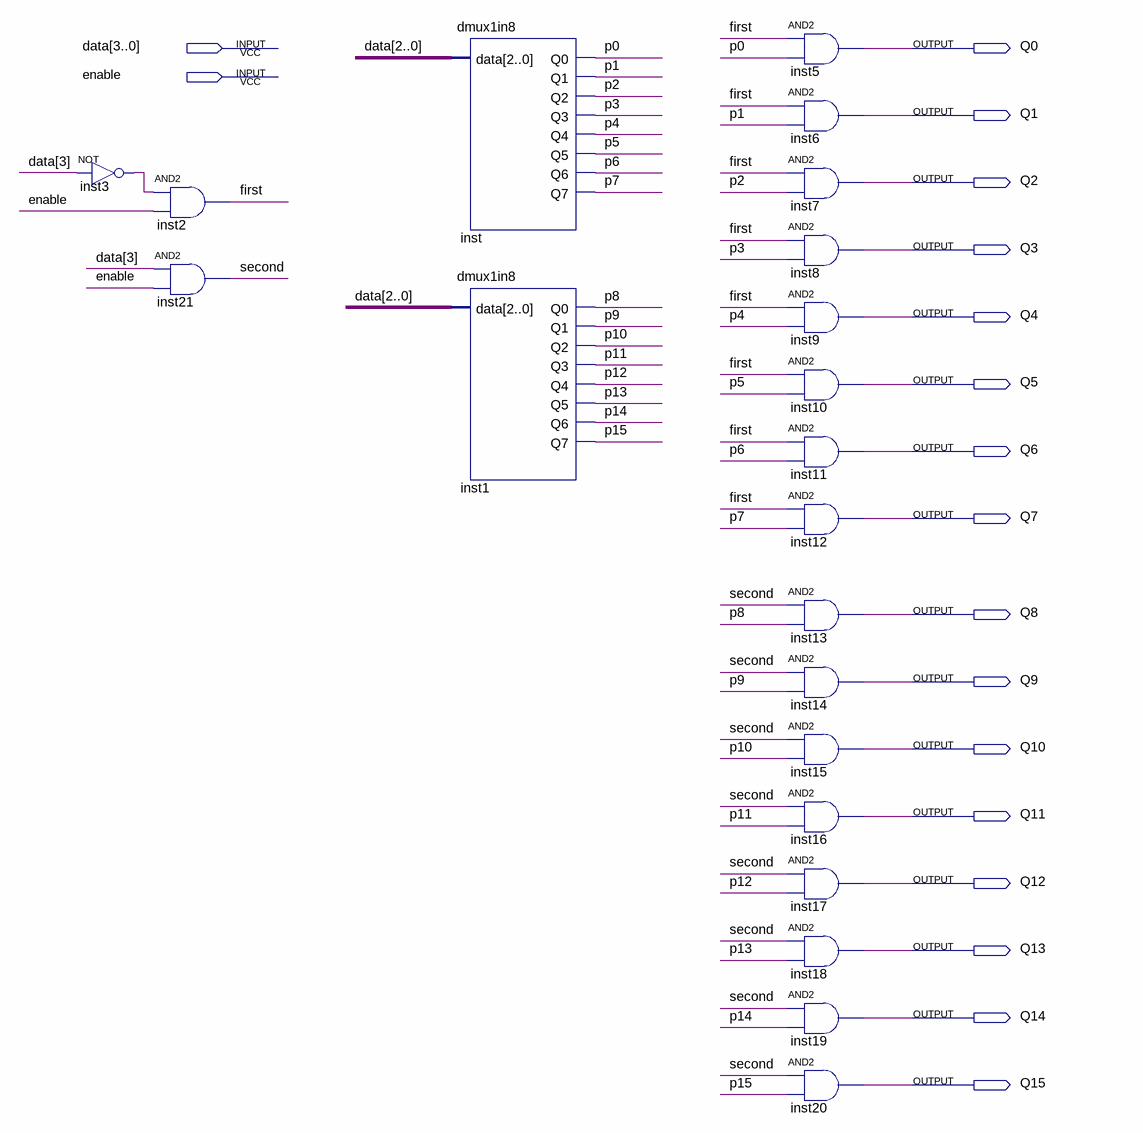
[diagram p0: schematic sheet]
// Quartus schematic dmux1in16.bdf as structural Verilog: 21 symbols, 18 pins
module dmux1in16 (
  input  [3:0] data,
  input  enable,
  output Q0,
  output Q1,
  output Q2,
  output Q3,
  output Q4,
  output Q5,
  output Q6,
  output Q7,
  output Q8,
  output Q9,
  output Q10,
  output Q11,
  output Q12,
  output Q13,
  output Q14,
  output Q15
);

  wire first, inst3_out, p0, p1, p2, p3, p4, p5, p6, p7, p8, p9, p10, p11, p12, p13, p14, p15, second;

  not inst3 (inst3_out, data[3]);
  and inst2 (first, inst3_out, enable);
  and inst21 (second, data[3], enable);
  dmux1in8 inst (.data(data[2:0]), .Q0(p0), .Q1(p1), .Q2(p2), .Q3(p3), .Q4(p4), .Q5(p5), .Q6(p6), .Q7(p7));
  dmux1in8 inst1 (.data(data[2:0]), .Q0(p8), .Q1(p9), .Q2(p10), .Q3(p11), .Q4(p12), .Q5(p13), .Q6(p14), .Q7(p15));
  and inst5 (Q0, first, p0);
  and inst6 (Q1, first, p1);
  and inst7 (Q2, first, p2);
  and inst8 (Q3, first, p3);
  and inst9 (Q4, first, p4);
  and inst10 (Q5, first, p5);
  and inst11 (Q6, first, p6);
  and inst12 (Q7, first, p7);
  and inst13 (Q8, second, p8);
  and inst14 (Q9, second, p9);
  and inst15 (Q10, second, p10);
  and inst16 (Q11, second, p11);
  and inst17 (Q12, second, p12);
  and inst18 (Q13, second, p13);
  and inst19 (Q14, second, p14);
  and inst20 (Q15, second, p15);
endmodule
